# Altium schematic sheet Spannungsversorgung.SchDoc
size A4
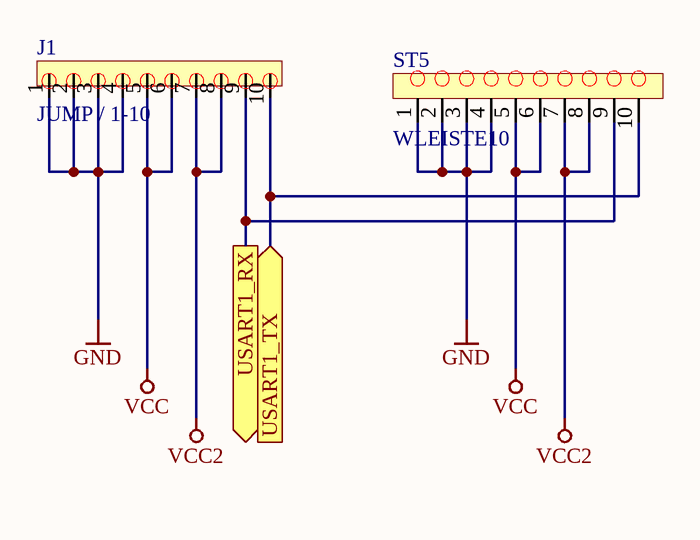
[diagram p0: Spannungsversorgung.SchDoc]

## Parts
J1  JUMP / 1-10  [JUMPER1/10]
ST5  WLEISTE10  [WLEISTE10_GERADE]

## Ports
USART1_RX (out), USART1_TX (in)

## Nets
GND: J1.1 J1.2 J1.3 J1.4 ST5.1 ST5.2 ST5.3 ST5.4
VCC: J1.5 J1.6 ST5.5 ST5.6
VCC2: J1.7 J1.8 ST5.7 ST5.8
USART1_RX: J1.9 ST5.9 ; port USART1_RX
USART1_TX: J1.10 ST5.10 ; port USART1_TX

## Library data of the parts
J1 = JUMP / 1-10: Stiftleiste 10polig RM2,54
ST5 = WLEISTE10: Wannenleiste 10polig